# Altium schematic sheet Sheet1.SchDoc
size A4; SheetNumber: 1; SheetTotal: 1
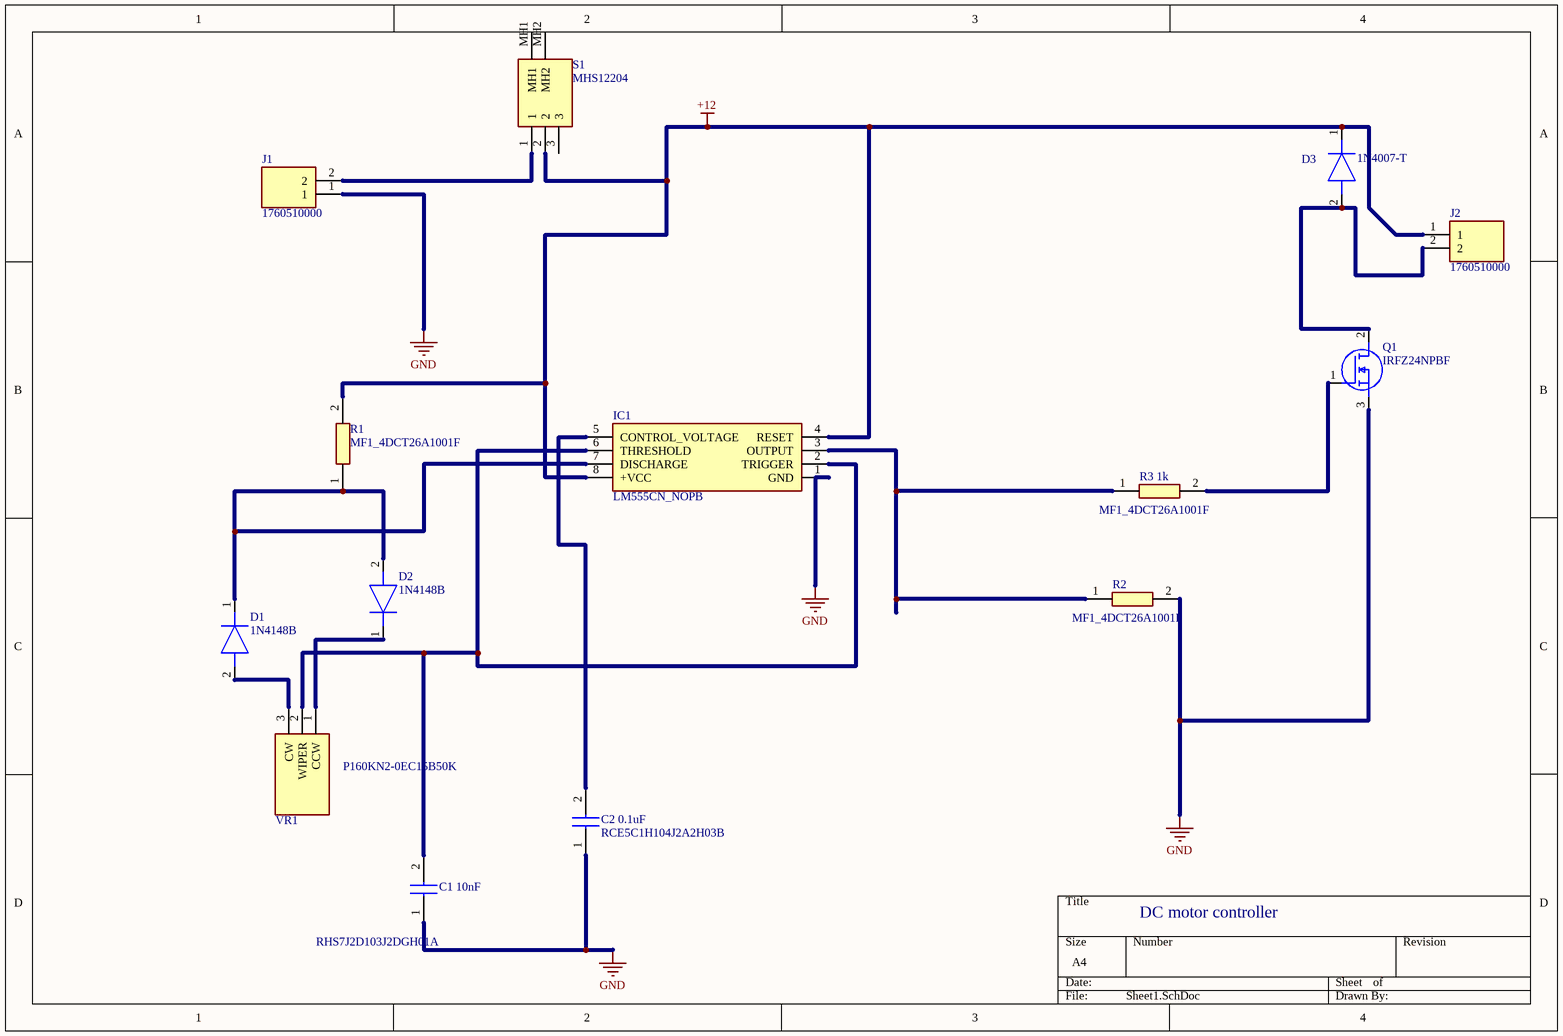
[diagram p0: Sheet1.SchDoc]

## Parts
C1_10nF  RHS7J2D103J2DGH01A  [RHS7J2D103J2DGH01A]
C2_0.1uF  RCE5C1H104J2A2H03B  [RCE5C1H104J2A2H03B]
D1  1N4148B  [DIOAD990W55L340D162]
D2  1N4148B  [DIOAD990W55L340D162]
D3  1N4007-T  [DIOAD1408W86L464D236]
IC1  LM555CN_NOPB  [DIP794W53P254L959H508Q8N]
J1  1760510000  [1760510000]
J2  1760510000  [1760510000]
Q1  IRFZ24NPBF  [TO254P469X1042X1967-3P]
R1  MF1_4DCT26A1001F  [RESAD1630W60L710D230]
R2  MF1_4DCT26A1001F  [RESAD1630W60L710D230]
R3_1k  MF1_4DCT26A1001F  [RESAD1630W60L710D230]
S1  MHS12204  [MHS12204]
VR1  P160KN2-0EC15B50K  [P160KN20EC15B50K]

## Nets
+12: D3.1(K) IC1.4(RESET) IC1.8(+VCC) J2.1 R1.2 S1.2
GND: C1_10nF.1 C2_0.1uF.1 IC1.1(GND) J1.1 Q1.3(S) R2.2
NetC1_10nF_2: C1_10nF.2 IC1.2(TRIGGER) IC1.6(THRESHOLD) VR1.2(WIPER)
NetC2_0.1uF_2: C2_0.1uF.2 IC1.5(CONTROL_VOLTAGE)
NetD1_1: D1.1(K) D2.2(A) IC1.7(DISCHARGE) R1.1
NetD1_2: D1.2(A) VR1.3(CW)
NetD2_1: D2.1(K) VR1.1(CCW)
NetD3_2: D3.2(A) J2.2 Q1.2(D)
NetIC1_3: IC1.3(OUTPUT) R2.1 R3_1k.1
NetJ1_2: J1.2 S1.1
NetQ1_1: Q1.1(G) R3_1k.2

Not connected (* = marked no-connect by the designer): S1 3 MH1 MH2

## Notes on the sheet
- DC motor controller

## Library data of the parts
C1_10nF = RHS7J2D103J2DGH01A: Capacitor; Manufacturer_Name: Murata Electronics; Datasheet Link: https://psearch.en.murata.com/capacitor/product/RHS7J2D103J2DGH01A.html; Height: 4mm; Manufacturer_Part_Number: RHS7J2D103J2DGH01A; Mouser Part Number: 81-RHS7J2D103J2DGH1A; Mouser Price/Stock: https://www.mouser.co.uk/ProductDetail/Murata-Electronics/RHS7J2D103J2DGH01A?qs=xhbEVWpZdWd37zfbUob1kg%3D%3D; Arrow Part Number: RHS7J2D103J2DGH01A; Arrow Price/Stock: https://www.arrow.com/en/products/rhs7j2d103j2dgh01a/murata-manufacturing?region=nac
C2_0.1uF = RCE5C1H104J2A2H03B: Capacitor; Manufacturer_Name: Murata Electronics; Datasheet Link: https://psearch.en.murata.com/capacitor/product/RCE5C1H104J2A2H03B.html; Height: 5.5mm; Manufacturer_Part_Number: RCE5C1H104J2A2H03B; Mouser Part Number: 81-RCE5C1H104J2A2H3B; Mouser Price/Stock: https://www.mouser.co.uk/ProductDetail/Murata-Electronics/RCE5C1H104J2A2H03B?qs=qSfuJ%252Bfl%2Fd7lCZVqlAdNaA%3D%3D
D1 D2 = 1N4148B: Diode; Manufacturer_Name: Vishay; Datasheet Link: https://www.vishay.com/docs/81857/1n4148.pdf; Manufacturer_Part_Number: 1N4148B
D3 = 1N4007-T: Diode; Manufacturer_Name: Vishay; Datasheet Link: https://www.diodes.com/assets/Datasheets/ds28002.pdf; Manufacturer_Part_Number: 1N4007-T; Mouser Part Number: N/A; Mouser Price/Stock: https://www.mouser.co.uk/ProductDetail/Vishay-Semiconductors/1N4007-T?qs=vcNEnGV6fuVmsrABXSI4cw%3D%3D
IC1 = LM555CN_NOPB: Integrated Circuit; Manufacturer_Name: Texas Instruments; Manufacturer_Part_Number: LM555CN/NOPB; Datasheet Link: https://datasheet.datasheetarchive.com/originals/distributors/Datasheets-SFU2/DSASFU100035550.pdf; Height: 5.08mm; Mouser Part Number: 926-LM555CN/NOPB; Mouser Price/Stock: https://www.mouser.co.uk/ProductDetail/Texas-Instruments/LM555CN-NOPB?qs=QbsRYf82W3GjZpQL%2FakZOg%3D%3D; Arrow Part Number: LM555CN/NOPB; Arrow Price/Stock: https://www.arrow.com/en/products/lm555cnnopb/texas-instruments?region=nac
J1 J2 = 1760510000: Connector; Manufacturer_Name: Weidmuller; Datasheet Link: http://catalog.weidmueller.com/createDatasheetForMobile.do?ordernumber=1760510000&scope1=1&scope2=1&localeId=en; Height: 10mm; Manufacturer_Part_Number: 1760510000; Mouser Part Number: 470-1760510000; Mouser Price/Stock: https://www.mouser.co.uk/ProductDetail/Weidmuller/1760510000?qs=BTG2th8YmhTa8qcglSF3eg%3D%3D
Q1 = IRFZ24NPBF: MOSFET (N-Channel); Manufacturer_Name: Infineon; Datasheet Link: https://www.mouser.com/datasheet/2/196/irfz24npbf-1227512.pdf; Height: 4.69mm; Manufacturer_Part_Number: IRFZ24NPBF; Mouser Part Number: 942-IRFZ24NPBF; Mouser Price/Stock: https://www.mouser.co.uk/ProductDetail/Infineon-Technologies/IRFZ24NPBF?qs=9%252BKlkBgLFf0TQgSTtY4J0g%3D%3D; Arrow Part Number: IRFZ24NPBF; Arrow Price/Stock: https://www.arrow.com/en/products/irfz24npbf/infineon-technologies-ag?utm_currency=USD&region=europe
R1 R2 R3_1k = MF1_4DCT26A1001F: Resistor; Manufacturer_Name: KOA Speer; Manufacturer_Part_Number: MF1/4DCT26A1001F; Datasheet Link: https://componentsearchengine.com/Datasheets/1/MF1_4DCT26A1001F.pdf; Mouser Part Number: 660-MF1/4DCT26A1001F; Mouser Price/Stock: https://www.mouser.co.uk/ProductDetail/KOA-Speer/MF1-4DCT26A1001F?qs=wVGympPcmnD9Oav1Pii0SQ%3D%3D
S1 = MHS12204: Switch; Manufacturer_Name: TE Connectivity; Datasheet Link: https://www.te.com/commerce/DocumentDelivery/DDEController?Action=srchrtrv&DocNm=1825255&DocType=Customer+Drawing&DocLang=English&DocFormat=pdf&PartCntxt=1825255-1; Height: 12mm; Manufacturer_Part_Number: MHS12204; Mouser Part Number: 506-MHS12204; Mouser Price/Stock: https://www.mouser.co.uk/ProductDetail/TE-Connectivity-Alcoswitch/MHS12204?qs=x%2FgbKjZ2T%2FPUluB%2FWhqq0Q%3D%3D; Arrow Part Number: MHS12204; Arrow Price/Stock: https://www.arrow.com/en/products/mhs12204/te-connectivity?region=nac
VR1 = P160KN2-0EC15B50K: Variable Resistor; Manufacturer_Name: TT Electronics; Datasheet Link: https://componentsearchengine.com/Datasheets/1/P160KN2-0EC15B50K.pdf; Height: 26.5mm; Manufacturer_Part_Number: P160KN2-0EC15B50K; Mouser Part Number: 858-P160KN20EC15B50K; Mouser Price/Stock: https://www.mouser.co.uk/ProductDetail/BI-Technologies-TT-Electronics/P160KN2-0EC15B50K?qs=%252BUYXD5bnyXpltOSO%252Bi0suQ%3D%3D; Arrow Part Number: P160KN2-0EC15B50K; Arrow Price/Stock: https://www.arrow.com/en/products/p160kn2-0ec15b50k/bi-technologies?utm_currency=USD&region=nac